# EAGLE board Controller Board (EAGLE 8.2.1), part 1 of 2
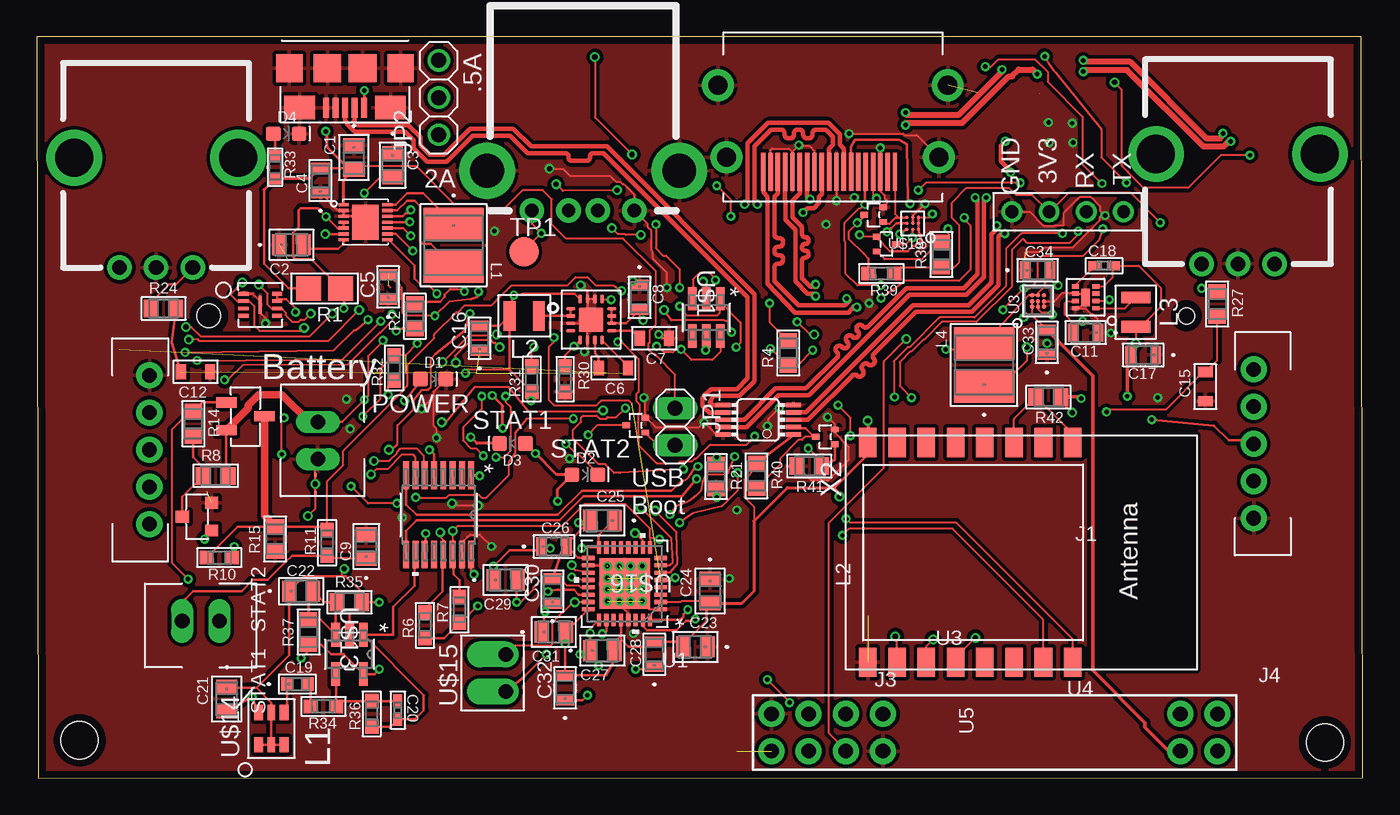
[diagram p5: board, top side]
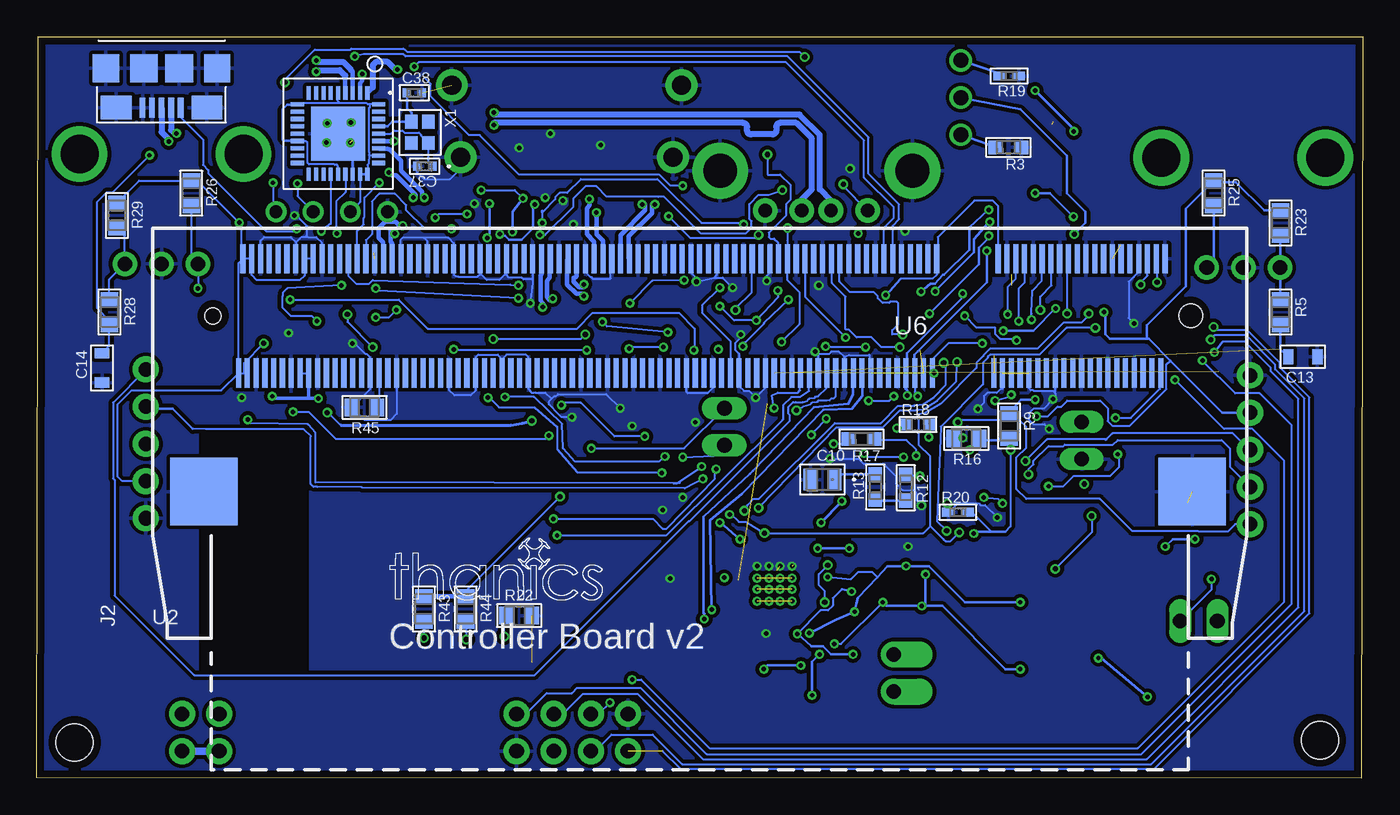
[diagram p6: board, bottom side, seen from below]

Size 90.62 x 50.65 mm. Coordinates in mm from the lower left corner, seen from the top.
Outline: 0.1,0 90.62,0.03 90.52,50.65 0,50.62 0.1,0
Copper layers (1*16): Top 0.035mm / dielectric 1.6mm / Bottom 0.035mm
Design rules "Elecrow_2-layer_PCB_eagle_rule *": minimum track width 6mil, minimum drill 12mil, track to track 6mil, track to pad 6mil, pad to pad 6mil, via to via 8mil, smd to smd 0mil, copper to edge 20mil, drill to drill 10mil, minimum pad ring 6mil, minimum via ring 6mil, stop-mask expansion 0mil, vias tented up to drill 100mil, thermal gap 10mil
Holes 2.54 mm at 88.03,2.44 2.94,2.59 109.67,14.53

## Footprints (pad centres in the part's own frame; a part is rotated, then mirrored left to right if it is on the bottom)
0805 = smd 0.965 x 1.448: 1 -0.826,0; 2 0.826,0
YAG_CC0805 = smd 0.965 x 1.448: 1 -0.826,0; 2 0.826,0
G-21 = smd 0.711 x 1.245: 1 -0.851,0; 2 0.851,0
0603_CAPACITOR = smd 0.701 x 1.001: 1 -1.001,0; 2 1.001,0
CC0402N-M = smd 0.864 x 0.61: 1 -0.635,0; 2 0.635,0
G-188-M = smd 0.813 x 0.914: 1 -0.699,0; 2 0.699,0
G-155-M = smd 0.559 x 0.61: 1 -0.521,0; 2 0.521,0
LED-0603 = smd 1 x 1: A -0.877,0; C 0.877,0
MSOP10 = smd 0.3 x 1.02: 1 -1,-2.4; 2 -0.5,-2.4; 3 0,-2.4; 4 0.5,-2.4; 5 1,-2.4; 6 1,2.4; 7 0.5,2.4; 8 0,2.4; 9 -0.5,2.4; 10 -1,2.4
JST-XH_5POS = drill 1 pad 1.778: 1 0,5.08; 2 0,2.54; 3 0,0; 4 0,-2.54; 5 0,-5.08
USB_MICRO_B_SMT = smd 0.4 x 1.35: 1 -1.3,0; 2 -0.65,0; 3 0,0; 4 0.65,0; 5 1.3,0 | smd 1.9 x 1.9: 6 -1.2,-2.68; 7 1.2,-2.68 | smd 2.1 x 1.6: P$1 -3.1,0; P$2 3.1,0 | smd 1.8 x 1.9: P$3 3.8,-2.68; P$4 -3.8,-2.68
XH_CONNECTOR = drill 1.001 long: 1 -1.27,0; 2 1.27,0
HDMI = smd 0.3 x 2.6: 1 4.75,4; 2 4.25,4; 3 3.75,4; 4 3.25,4; 5 2.75,4; 6 2.25,4; 7 1.75,4; 8 1.25,4; 9 0.75,4; 10 0.25,4; 11 -0.25,4; 12 -0.75,4; 13 -1.25,4; 14 -1.75,4; 15 -2.25,4; 16 -2.75,4; 17 -3.25,4; 18 -3.75,4; 19 -4.25,4 | drill 1.3 pad 2.184: P$1 7.25,3; P$2 -7.25,3; P$3 -7.85,-1.9; P$4 7.85,-1.9
1X02 = drill 1.016 long: 1 -1.27,0; 2 1.27,0
1X03 = drill 1.016: 1 -2.54,0; 2 0,0; 3 2.54,0
IND_IFSC_1515AH-M = smd 2.21 x 4.115: 1 -1.46,0; 2 1.46,0
470NH_INDUCTOR = smd 0.8 x 2: P$1 -1,0; P$2 1,0
1206 = smd 1.727 x 1.676: 1 -1.092,0; 2 1.092,0
RC0805N = smd 1.006 x 1.2: 1 -0.853,0; 2 0.853,0
RC0603N-M = smd 0.965 x 0.914: 1 -0.876,0; 2 0.876,0
RC0603N = smd 0.762 x 0.813: 1 -0.775,0; 2 0.775,0
RC0402N-M = smd 0.864 x 0.61: 1 -0.66,0; 2 0.66,0
TP20R = smd 2 x 2: TP 0,0
AAT3620_TDFN = smd 0.7 x 0.22: 1 -1.5,1.2; 2 -1.5,0.8; 3 -1.5,0.4; 4 -1.5,0; 5 -1.5,-0.4; 6 -1.5,-0.8; 7 -1.5,-1.2; 8 1.5,-1.2; 9 1.5,-0.8; 10 1.5,-0.4; 11 1.5,0; 12 1.5,0.4; 13 1.5,0.8; 14 1.5,1.2 | smd 1.8 x 2.4: EP 0,0
21-0055H_16-M = smd 1.905 x 0.406: 1 -2.705,2.223; 2 -2.705,1.587; 3 -2.705,0.953; 4 -2.705,0.318; 5 -2.705,-0.318; 6 -2.705,-0.953; 7 -2.705,-1.587; 8 -2.705,-2.223; 9 2.705,-2.223; 10 2.705,-1.587; 11 2.705,-0.953; 12 2.705,-0.318; 13 2.705,0.318; 14 2.705,0.953; 15 2.705,1.587; 16 2.705,2.223
YFF9 = smd 0.3 x 0.3: A1 -0.4,0.4; A2 0,0.4; A3 0.4,0.4; B1 -0.4,0; B2 0,0; B3 0.4,0; C1 -0.4,-0.4; C2 0,-0.4; C3 0.4,-0.4
SC59_MOSFET = smd 0.7 x 1.4: D 0,1.3; G -0.95,-1.3; S 0.95,-1.3
SOT-23_(TO-236AB) = smd 0.8 x 0.9: D 0,-1; G 0.95,1; S -0.95,1
SO-DIMM = smd 0.35 x 2: 1 -26.4,-3.9; 2 -26.1,3.9; 3 -25.8,-3.9; 4 -25.5,3.9; 5 -25.2,-3.9; 6 -24.9,3.9; 7 -24.6,-3.9; 8 -24.3,3.9; 9 -24,-3.9; 10 -23.7,3.9; 11 -23.4,-3.9; 12 -23.1,3.9; 13 -22.8,-3.9; 14 -22.5,3.9; 15 -22.2,-3.9; 16 -21.9,3.9; 17 -21.6,-3.9; 18 -21.3,3.9; 19 -21,-3.9; 20 -20.7,3.9; 21 -20.4,-3.9; 22 -20.1,3.9; 23 -19.8,-3.9; 24 -19.5,3.9; 25 -19.2,-3.9; 26 -18.9,3.9; 27 -18.6,-3.9; 28 -18.3,3.9; 29 -18,-3.9; 30 -17.7,3.9; 31 -17.4,-3.9; 32 -17.1,3.9; 33 -16.8,-3.9; 34 -16.5,3.9; 35 -16.2,-3.9; 36 -15.9,3.9; 37 -15.6,-3.9; 38 -15.3,3.9; 39 -15,-3.9; 40 -14.7,3.9; 41 -10.8,-3.9; 42 -10.5,3.9; 43 -10.2,-3.9; 44 -9.9,3.9; 45 -9.6,-3.9; 46 -9.3,3.9; 47 -9,-3.9; 48 -8.7,3.9; 49 -8.4,-3.9; 50 -8.1,3.9; 51 -7.8,-3.9; 52 -7.5,3.9; 53 -7.2,-3.9; 54 -6.9,3.9; 55 -6.6,-3.9; 56 -6.3,3.9; 57 -6,-3.9; 58 -5.7,3.9; 59 -5.4,-3.9; 60 -5.1,3.9; 61 -4.8,-3.9; 62 -4.5,3.9; 63 -4.2,-3.9; 64 -3.9,3.9; 65 -3.6,-3.9; 66 -3.3,3.9; 67 -3,-3.9; 68 -2.7,3.9; 69 -2.4,-3.9; 70 -2.1,3.9; 71 -1.8,-3.9; 72 -1.5,3.9; 73 -1.2,-3.9; 74 -0.9,3.9; 75 -0.6,-3.9; 76 -0.3,3.9; 77 0,-3.9; 78 0.3,3.9; 79 0.6,-3.9; 80 0.9,3.9; 81 1.2,-3.9; 82 1.5,3.9; 83 1.8,-3.9; 84 2.1,3.9; 85 2.4,-3.9; 86 2.7,3.9; 87 3,-3.9; 88 3.3,3.9; 89 3.6,-3.9; 90 3.9,3.9; 91 4.2,-3.9; 92 4.5,3.9; 93 4.8,-3.9; 94 5.1,3.9; 95 5.4,-3.9; 96 5.7,3.9; 97 6,-3.9; 98 6.3,3.9; 99 6.6,-3.9; 100 6.9,3.9; 101 7.2,-3.9; 102 7.5,3.9; 103 7.8,-3.9; 104 8.1,3.9; 105 8.4,-3.9; 106 8.7,3.9; 107 9,-3.9; 108 9.3,3.9; 109 9.6,-3.9; 110 9.9,3.9; 111 10.2,-3.9; 112 10.5,3.9; 113 10.8,-3.9; 114 11.1,3.9; 115 11.4,-3.9; 116 11.7,3.9; 117 12,-3.9; 118 12.3,3.9; 119 12.6,-3.9; 120 12.9,3.9; 121 13.2,-3.9; 122 13.5,3.9; 123 13.8,-3.9; 124 14.1,3.9; 125 14.4,-3.9; 126 14.7,3.9; 127 15,-3.9; 128 15.3,3.9; 129 15.6,-3.9; 130 15.9,3.9; 131 16.2,-3.9; 132 16.5,3.9; 133 16.8,-3.9; 134 17.1,3.9; 135 17.4,-3.9; 136 17.7,3.9; 137 18,-3.9; 138 18.3,3.9; 139 18.6,-3.9; 140 18.9,3.9; 141 19.2,-3.9; 142 19.5,3.9; 143 19.8,-3.9; 144 20.1,3.9; 145 20.4,-3.9; 146 20.7,3.9; 147 21,-3.9; 148 21.3,3.9; 149 21.6,-3.9; 150 21.9,3.9; 151 22.2,-3.9; 152 22.5,3.9; 153 22.8,-3.9; 154 23.1,3.9; 155 23.4,-3.9; 156 23.7,3.9; 157 24,-3.9; 158 24.3,3.9; 159 24.6,-3.9; 160 24.9,3.9; 161 25.2,-3.9; 162 25.5,3.9; 163 25.8,-3.9; 164 26.1,3.9; 165 26.4,-3.9; 166 26.7,3.9; 167 27,-3.9; 168 27.3,3.9; 169 27.6,-3.9; 170 27.9,3.9; 171 28.2,-3.9; 172 28.5,3.9; 173 28.8,-3.9; 174 29.1,3.9; 175 29.4,-3.9; 176 29.7,3.9; 177 30,-3.9; 178 30.3,3.9; 179 30.6,-3.9; 180 30.9,3.9; 181 31.2,-3.9; 182 31.5,3.9; 183 31.8,-3.9; 184 32.1,3.9; 185 32.4,-3.9; 186 32.7,3.9; 187 33,-3.9; 188 33.3,3.9; 189 33.6,-3.9; 190 33.9,3.9; 191 34.2,-3.9; 192 34.5,3.9; 193 34.8,-3.9; 194 35.1,3.9; 195 35.4,-3.9; 196 35.7,3.9; 197 36,-3.9; 198 36.3,3.9; 199 36.6,-3.9; 200 36.9,3.9 | smd 4.6 x 4.6: G1 -28.254,12; G2 39.27,12 | hole 1.6: -28.15,0 | hole 1.1: 38.65,0
MF06A-M = smd 1.575 x 0.584: 1 -1.27,0.953; 2 -1.27,0; 3 -1.27,-0.953; 4 1.27,-0.953; 5 1.27,0; 6 1.27,0.953
PG-USON-8-1 = smd 0.7 x 0.25: 1 -1.15,0.75; 2 -1.15,0.25; 3 -1.15,-0.25; 4 -1.15,-0.75; 5 1.15,-0.75; 6 1.15,-0.25; 7 1.15,0.25; 8 1.15,0.75 | smd 0.2 x 1.2: 9 0,0
4_PIN_TELE_CONNECTOR = drill 0.87 pad 1.422: 1 0,3.81; 2 0,1.27; 3 0,-1.27; 4 0,-3.81
MLF(ML)_8PIN = smd 0.5 x 0.3: 1 -0.7,0.75; 2 -0.7,0.25; 3 -0.7,-0.25; 4 -0.7,-0.75; 5 0.7,-0.75; 6 0.7,-0.25; 7 0.7,0.25; 8 0.7,0.75 | smd 0.6 x 1.2: EP 0,0
VQFN16 = smd 0.6 x 0.24: 1 -1.4,0.75; 2 -1.4,0.25; 3 -1.4,-0.25; 4 -1.4,-0.75; 9 1.4,-0.75; 10 1.4,-0.25; 11 1.4,0.25; 12 1.4,0.75 | smd 0.24 x 0.6: 5 -0.75,-1.4; 6 -0.25,-1.4; 7 0.25,-1.4; 8 0.75,-1.4; 13 0.75,1.4; 14 0.25,1.4; 15 -0.25,1.4; 16 -0.75,1.4 | smd 1.68 x 1.68: 17 0,0
PEC12R = drill 2.6 pad 3.81: 1 -5.6,7.5; 2 5.6,7.5 | drill 1 pad 1.676: A -2.5,0; B 2.5,0; C 0,0
USB_A_RECEPT = drill 0.92 pad 1.676: 1 3.5,0; 2 1,0; 3 -1,0; 4 -3.5,0 | drill 2.3 pad 3.81: 5 -6.57,-2.71; 6 6.57,-2.71
3.5_TOUCHSCREEN = drill 1 pad 1.778: 1 -12.7,1.27; 2 -10.16,1.27; 3 10.16,1.27; 4 12.7,1.27; 5 15.24,1.27; 6 17.78,1.27; 7 17.78,-1.27; 8 15.24,-1.27; 9 12.7,-1.27; 10 10.16,-1.27; 11 -10.16,-1.27; 12 -12.7,-1.27
SOT-23-5_MC-M = smd 1.626 x 0.61: 1 -1.346,0.95; 2 -1.346,0; 3 -1.346,-0.95; 4 1.346,-0.95; 5 1.346,0.95
SISONIC_MICROPHONE = smd 1.032 x 0.622: 1 -1.104,0.884; 3 -1.104,-0.884; 4 1.104,-0.884; 6 1.104,0.884 | smd 1.032 x 0.5: 2 -1.104,0; 5 1.104,0
SPEAKER = drill 0.991 pad 1.778 offset: 1 -1.27,0; 2 1.27,0
RHB32_3P45X3P45 = smd 0.85 x 0.28: 1 -2.475,1.75; 2 -2.475,1.25; 3 -2.475,0.75; 4 -2.475,0.25; 5 -2.475,-0.25; 6 -2.475,-0.75; 7 -2.475,-1.25; 8 -2.475,-1.75; 17 2.475,-1.75; 18 2.475,-1.25; 19 2.475,-0.75; 20 2.475,-0.25; 21 2.475,0.25; 22 2.475,0.75; 23 2.475,1.25; 24 2.475,1.75 | smd 0.28 x 0.85: 9 -1.75,-2.475; 10 -1.25,-2.475; 11 -0.75,-2.475; 12 -0.25,-2.475; 13 0.25,-2.475; 14 0.75,-2.475; 15 1.25,-2.475; 16 1.75,-2.475; 25 1.75,2.475; 26 1.25,2.475; 27 0.75,2.475; 28 0.25,2.475; 29 -0.25,2.475; 30 -0.75,2.475; 31 -1.25,2.475; 32 -1.75,2.475 | smd 3.45 x 3.45: 33 0,0
SOT-523 = smd 0.4 x 0.51: D 0,0.65; G -0.5,-0.65; S 0.5,-0.65
WLCSP9 = smd 0.25 x 0.25: A1 -0.4,0.4; A2 0,0.4; A3 0.4,0.4; B1 -0.4,0; B2 0,0; B3 0.4,0; C1 -0.4,-0.4; C2 0,-0.4; C3 0.4,-0.4
36-SQFN = smd 0.9 x 0.28: 1 -2.775,2; 2 -2.775,1.5; 3 -2.775,1; 4 -2.775,0.5; 5 -2.775,0; 6 -2.775,-0.5; 7 -2.775,-1; 8 -2.775,-1.5; 9 -2.775,-2; 19 2.775,-2; 20 2.775,-1.5; 21 2.775,-1; 22 2.775,-0.5; 23 2.775,0; 24 2.775,0.5; 25 2.775,1; 26 2.775,1.5; 27 2.775,2 | smd 0.28 x 0.9: 10 -2,-2.775; 11 -1.5,-2.775; 12 -1,-2.775; 13 -0.5,-2.775; 14 0,-2.775; 15 0.5,-2.775; 16 1,-2.775; 17 1.5,-2.775; 18 2,-2.775; 28 2,2.775; 29 1.5,2.775; 30 1,2.775; 31 0.5,2.775; 32 0,2.775; 33 -0.5,2.775; 34 -1,2.775; 35 -1.5,2.775; 36 -2,2.775 | smd 3.7 x 3.7: EP 0,0
AGND-DGND = smd 0.178 x 0.254: 1 0,0.635; 2 0,-0.635 | drill 0.356: 3 0,0
FA-128 = smd 0.95 x 0.85: 1 -0.725,-0.575; 2 0.725,-0.575; 3 0.725,0.575; 4 -0.725,0.575
ESP-12 = smd 2 x 1.2: 1 -7.5,4.5; 2 -7.5,2.5; 3 -7.5,0.5; 4 -7.5,-1.5; 5 -7.5,-3.5; 6 -7.5,-5.5; 7 -7.5,-7.5; 8 -7.5,-9.5; 9 7.5,-9.5; 10 7.5,-7.5; 11 7.5,-5.5; 12 7.5,-3.5; 13 7.5,-1.5; 14 7.5,0.5; 15 7.5,2.5; 16 7.5,4.5

## Placement (x,y rotation side)
C1  0.1uF  [0805]  21.68,42.39 270 top
C2  0.1uF  [0805]  17.41,36.42 0 top
C3  1uF  [YAG_CC0805]  24.32,41.86 270 top
C4  10uF  [G-21]  19.4,40.82 90 top
C5  22uF  [G-21]  24.02,33.55 90 top
C6  10nF  [0603_CAPACITOR]  39.41,28.02 180 top
C7  10nF  [0603_CAPACITOR]  42.2,30.05 180 top
C8  10uF  [G-21]  41.19,32.84 270 top
C9  1uF  [YAG_CC0805]  22.52,15.82 90 top
C10  0.1uF  [0805]  36.92,20.4 180 bottom
C11  10uF  [G-21]  71.67,30.43 180 top
C12  10nF  [0603_CAPACITOR]  10.86,27.76 180 top
C13  10nF  [0603_CAPACITOR]  4.1,28.78 180 bottom
C14  10nF  [0603_CAPACITOR]  86.15,28.02 90 bottom
C15  10nF  [0603_CAPACITOR]  79.85,26.75 90 top
C16  22uF  [G-21]  30.27,30.05 90 top
C17  10uF  [G-21]  75.61,28.91 180 top
C18  560pF  [CC0402N-M]  72.94,35 0 top
C19  2.2uF  [G-188-M]  17.82,6.43 0 top
C20  560pF  [CC0402N-M]  24.68,4.65 270 top
C21  0.1uF  [0805]  12.99,5.41 270 top
C22  1uF  [YAG_CC0805]  18.07,12.78 0 top
C23  0.1uF  [0805]  45,8.97 180 top
C24  0.1uF  [0805]  46.01,12.78 270 top
C25  0.1uF  [0805]  38.65,17.6 180 top
C26  10uF  [G-21]  35.35,15.82 0 top
C27  0.1uF  [0805]  38.65,8.71 0 top
C28  10uF  [G-21]  42.2,8.46 90 top
C29  0.1uF  [0805]  32.04,13.54 0 top
C30  22uF  [G-21]  35.25,12.78 90 top
C31  0.1uF  [0805]  35.35,9.98 0 top
C32  22uF  [G-21]  36.11,6.17 90 top
C33  10uF  [G-21]  69.03,29.77 90 top
C34  10uF  [G-21]  68.39,34.7 0 top
C37  16pF  [G-155-M]  64.1,41.78 180 bottom
C38  16pF  [G-155-M]  64.81,46.81 0 bottom
D1  GREEN  [LED-0603]  27.09,27.25 0 top
D2  GREEN  [LED-0603]  37.47,20.73 0 top
D3  GREEN  [LED-0603]  32.52,22.86 180 top
D4  GREEN  [LED-0603]  17.06,44.02 0 top
IC1  FSUSB42MSOP10  [MSOP10]  49.3,24.48 90 top
J1  JOYSTICK  [JST-XH_5POS]  7.71,22.43 0 top
J2  JOYSTICK  [JST-XH_5POS]  83.15,22.83 180 top
J3  USB_MICRO_B_SMT  [USB_MICRO_B_SMT]  21.07,45.8 180 top
J4  2_PIN_CONNECTOR  [XH_CONNECTOR]  11.22,10.74 180 top
J5  USB_MICRO_B_SMT  [USB_MICRO_B_SMT]  82.08,45.8 180 bottom
J6  POWER_CONNECTOR  [XH_CONNECTOR]  19.22,23.06 270 top
J7  HDMI  [HDMI]  54.4,45.42 180 top
JP1  [1X02]  43.63,24 270 top
JP2  [1X03]  27.47,46.48 90 top
L1  4.7uH  [IND_IFSC_1515AH-M]  28.49,36.4 270 top
L2  470nH  [470NH_INDUCTOR]  33.31,31.57 180 top
L3  470nH  [470NH_INDUCTOR]  75.1,31.83 270 top
L4  4.7uH  [IND_IFSC_1515AH-M]  64.73,28.22 90 top
R1  100  [1206]  19.67,33.45 180 top
R2  10k  [RC0805N]  25.85,31.55 90 top
R3  100k  [RC0603N-M]  24.22,43.08 180 bottom
R4  10k  [RC0805N]  51.35,29.03 90 top
R5  10k  [RC0805N]  5.63,31.83 270 bottom
R6  1k  [RC0603N-M]  26.53,10.44 90 top
R7  1k  [RC0603N-M]  28.9,11.51 90 top
R8  10k  [RC0805N]  12.23,20.65 0 top
R9  10k  [RC0805N]  24.17,24.05 270 bottom
R10  100k  [RC0603N-M]  12.49,15.06 180 top
R11  1M  [RC0603N-M]  19.85,16.08 90 top
R12  1k  [RC0603N-M]  31.23,19.84 270 bottom
R13  1k  [RC0603N-M]  33.31,19.89 90 bottom
R14  10k  [RC0805N]  10.71,24.21 270 top
R15  10k  [RC0805N]  16.3,16.33 90 top
R16  10k  [RC0805N]  27.09,23.19 180 bottom
R17  20R  [RC0603N-M]  34.25,23.16 180 bottom
R18  340R  [RC0603N]  30.39,24.16 0 bottom
R19  24.9k  [RC0402N-M]  24.17,47.96 180 bottom
R20  24.9k  [RC0402N-M]  27.68,18.16 0 bottom
R21  10k  [RC0805N]  46.42,20.6 270 top
R22  10k  [RC0805N]  57.65,11.1 0 bottom
R23  10k  [RC0805N]  5.63,37.92 270 bottom
R24  10k  [RC0805N]  8.68,32.08 0 top
R25  10k  [RC0805N]  10.2,39.95 270 bottom
R26  10k  [RC0805N]  80.05,39.95 270 bottom
R27  10k  [RC0805N]  80.66,32.38 270 top
R28  10k  [RC0805N]  85.64,31.83 270 bottom
R29  10k  [RC0805N]  85.13,38.43 270 bottom
R30  160k  [RC0603N-M]  36.11,27.25 270 top
R31  499k  [RC0603N-M]  33.82,27.25 90 top
R32  20R  [RC0603N-M]  24.42,28.02 90 top
R33  340R  [RC0603N]  16.3,41.73 270 top
R34  1k  [RC0603N-M]  19.6,4.9 180 top
R35  10k  [RC0805N]  21.38,12.01 0 top
R36  100k  [RC0603N-M]  22.9,4.39 90 top
R37  10k  [RC0805N]  18.58,9.98 90 top
R38  NF  [RC0805N]  61.81,35.76 90 top
R39  100k  [RC0603N-M]  57.72,34.47 180 top
R40  10k  [RC0805N]  49.19,20.65 270 top
R41  10k  [RC0805N]  52.8,21.31 180 top
R42  10k  [RC0805N]  69.13,26.04 180 top
R43  10k  [RC0805N]  64.15,11.56 270 bottom
R44  10k  [RC0805N]  61.31,11.56 270 bottom
R45  10k  [RC0805N]  68.21,25.32 180 bottom
TP1  TPSQTP20R  [TP20R]  33.31,35.97 0 top
U1  AAT3620_BATT_CHARGER  [AAT3620_TDFN]  22.47,37.97 0 top
U2  8 CH  [21-0055H_16-M]  27.47,17.98 270 top
U3  [YFF9]  68.42,32.59 90 top
U4  DMP3030SN_MOSFET  [SC59_MOSFET]  14.26,24.71 270 top
U5  [SOT-23_(TO-236AB)]  10.96,17.86 270 top
U6  COMPUTE_MODULE  [SO-DIMM]  39.92,31.57 180 bottom
U$1  LM3880MF-1AA/NOPBMF06A-M  [MF06A-M]  45.76,31.47 270 top
U$2  APPLE_2.0C_COPROCESSOR  [PG-USON-8-1]  15.28,32.33 0 top
U$3  4_PIN_TELE_CONNECTOR  [4_PIN_TELE_CONNECTOR]  70.45,38.68 270 top
U$4  MIC23050  [MLF(ML)_8PIN]  71.67,32.84 180 top
U$5  TPS6209  [VQFN16]  37.89,31.32 0 top
U$9  PEC12R  [PEC12R]  8.17,34.87 0 top
U$10  PEC12R  [PEC12R]  82.08,35.13 0 top
U$11  USB_A_RECEPT  [USB_A_RECEPT]  37.34,38.77 180 top
U$12  3.5_TOUCHSCREEN  [3.5_TOUCHSCREEN]  67.99,3.12 180 top
U$13  [SOT-23-5_MC-M]  21.38,8.46 270 top
U$14  [SISONIC_MICROPHONE]  16.04,3.38 90 top
U$15  [SPEAKER]  32.04,7.19 90 top
U$16  [RHB32_3P45X3P45]  40.17,13.28 180 top
U$18  [SOT-523]  58.05,36.47 270 top
U$19  ESD5384  [WLCSP9]  59.86,37.9 180 top
U$20  [SOT-523]  40.93,24.1 90 top
U$21  [SOT-523]  57.19,38.48 90 top
U$23  [SOT-523]  53.89,23.32 90 top
U$24  [36-SQFN]  70.02,44.02 270 bottom
U$25  AGND-DGND  [AGND-DGND]  19.04,20.09 180 top
X1  24MHZ  [FA-128]  64.44,44.11 270 bottom
X2  [ESP-12]  66.28,15.42 270 top